# EAGLE design USB_mini_board (EAGLE 9.6.2)
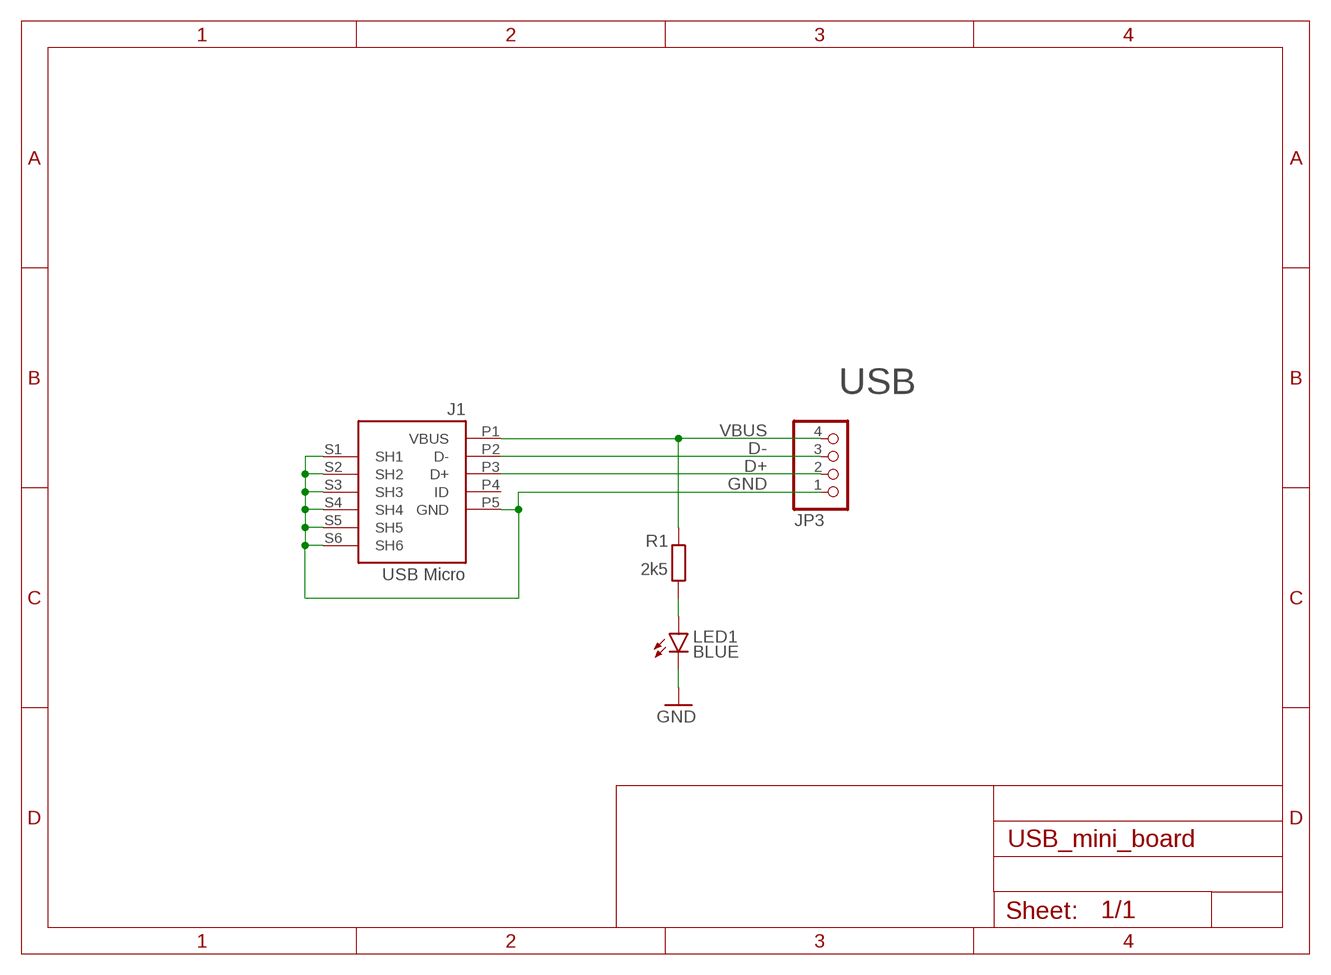
[diagram p0: schematic, sheet 1]

## Parts
J1  USB Micro  USB-MICRO-LEGACY  [CON2_USB_MICRO_B_AT]
JP3  PINHD-1X4  [1X04]
LED1  BLUE  LEDCHIP-LED0805  [CHIP-LED0805]
R1  2k5  R-EU_R1206  [R1206]

## Nets
D+ [usb]: J1.P3(D+) JP3.2
D- [usb]: J1.P2(D-) JP3.3
GND [usb]: J1.P5(GND) J1.S1(SH1) J1.S2(SH2) J1.S3(SH3) J1.S4(SH4) J1.S5(SH5) J1.S6(SH6) JP3.1 LED1.C
N$13: LED1.A R1.2
VBUS [usb]: J1.P1(VBUS) JP3.4 R1.1
Unconnected: J1.P4(ID)

## Notes on the sheet
- USB

## Library data of the parts
J1 = Arduino-connectors:USB-MICRO-LEGACY; DATASHEET: http://media.digikey.com/pdf/Data%20Sheets/FCI%20PDFs/10118193-0001LF_Webpage.PDF; DISTRIBUTOR-LINK: http://www.digikey.it/product-detail/en/10118193-0001LF/609-4616-2-ND/2785388; DISTRIBUTOR-PN: 609-4616-2-ND; MANUFACTURER: FCI; MANUFACTURER-PN: 10118193-0001LF
JP3 = pinhead:PINHD-1X4: PIN HEADER
LED1 = led:LED: LED OSRAM: - CHIPLED LG R971, LG N971, LY N971, LG Q971, LY Q971, LO R971, LY R971 LH N974, LH R974 LS Q976, LO Q976, LY Q976 LO Q996 - Hyper CHIPLED LW Q18S LB Q993, LB Q99A, LB R99A - SideLED LS A670, LO A670, LY A670, LG A670, LP A670 LB A673, LV A673, LT A673, LW A673 LH A674 LY A675 LS A676, LA A676, LO A676, LY A676, LW A676 LS A679, LY A679, LG A679 - Hyper Micro SIDELED® LS Y876, LA Y876, LO Y876, LY Y876 LT Y87S - SmartLED LW L88C, LW L88S LB L89C, LB L89S, LG L890 LS L89K, LO L89K, LY L89K LS L896, LA L896, LO L896, LY L896 - TOPLED LS T670, LO T670, LY T670, LG T670, LP T670 LSG T670, LSP T670, LSY T670, LOP T670, LYG T670 LG T671, LOG T671, LSG T671 LB T673, LV T673, LT T673, LW T673 LH T674 LS T676, LA T676, LO T676, LY T676, LB T676, LH T676, LSB T676, LW T676 LB T67C, LV T67C, LT T67C, LS T67K, LO T67K, LY T67K, LW E67C LS E67B, LA E67B, LO E67B, LY E67B, LB E67C, LV E67C, LT E67C LW T67C LS T679, LY T679, LG T679 LS T770, LO T770, LY T770, LG T770, LP T770 LB T773, LV T773, LT T773, LW T773 LH T774 LS E675, LA E675, LY E675, LS T675 LS T776, LA T776, LO T776, LY T776, LB T776 LHGB T686 LT T68C, LB T68C - Hyper Mini TOPLED® LB M676 - Mini TOPLED Santana® LG M470 LS M47K, LO M47K, LY M47K Source: http://www.osram.convergy.de LUXEON: - LUMILED® LXK2-PW12-R00, LXK2-PW12-S00, LXK2-PW14-U00, LXK2-PW14-V00 LXK2-PM12-R00, LXK2-PM12-S00, LXK2-PM14-U00 LXK2-PE12-Q00, LXK2-PE12-R00, LXK2-PE12-S00, LXK2-PE14-T00, LXK2-PE14-U00 LXK2-PB12-K00, LXK2-PB12-L00, LXK2-PB12-M00, LXK2-PB14-N00, LXK2-PB14-P00, LXK2-PB14-Q00 LXK2-PR12-L00, LXK2-PR12-M00, LXK2-PR14-Q00, LXK2-PR14-R00 LXK2-PD12-Q00, LXK2-PD12-R00, LXK2-PD12-S00 LXK2-PH12-R00, LXK2-PH12-S00 LXK2-PL12-P00, LXK2-PL12-Q00, LXK2-PL12-R00 Source: www.luxeon.com KINGBRIGHT: KA-3528ASYC Source: www.kingbright.com
R1 = rcl:R-EU_: RESISTOR, European symbol; SPICEPREFIX: R

## Net classes
0 default: width 0.61 mm, clearance 0.305 mm
1 usb: width 0.406 mm, clearance 0.076 mm

## Board
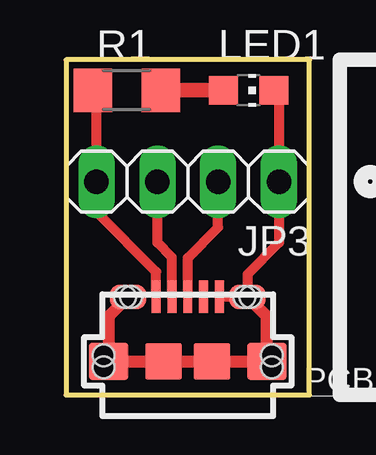
[diagram p1: board, top side]

Size 10.16 x 13.97 mm. Coordinates in mm from the lower left corner, seen from the top.
Outline: 0,0 10.16,0 10.16,13.97 0,13.97 0,0
Copper layers (1*16): Top 0.035mm / dielectric 1.5mm / Bottom 0.035mm
Design rules "default *": minimum track width 6mil, minimum drill 0.35mm, track to track 6mil, track to pad 6mil, pad to pad 6mil, via to via 6mil, smd to smd 6mil, copper to edge 5mil, drill to drill 6mil, minimum pad ring 10mil, minimum via ring 8mil, stop-mask expansion 4mil, vias tented up to drill 0mil, thermal gap 10mil

### Footprints (pad centres in the part's own frame; a part is rotated, then mirrored left to right if it is on the bottom)
CON2_USB_MICRO_B_AT = smd 0.406 x 1.346: P1 -1.321,2.692; P2 -0.66,2.692; P3 0,2.692; P4 0.66,2.692; P5 1.321,2.692 | smd 1.651 x 1.549: S1 -3.302,0; S2 3.302,0 | smd 1.524 x 1.016: S3 -2.489,2.692; S4 2.489,2.692 | smd 1.524 x 1.524: S5 -1.016,0; S6 1.016,0 | hole 0.9: -3.505,0.254; -3.505,-0.254; 3.505,0.254; 3.505,-0.254; -2.616,2.692; -2.362,2.692; 2.362,2.692; 2.616,2.692
1X04 = drill 1.016 long: 1 -3.81,0; 2 -1.27,0; 3 1.27,0; 4 3.81,0
CHIP-LED0805 = smd 1.2 x 1.2: A 0,-1.05; C 0,1.05
R1206 = smd 1.6 x 1.803: 1 -1.422,0; 2 1.422,0

### Placement (x,y rotation side)
J1  5.08,1.4 0 top
JP3  5.08,8.89 180 top
LED1  7.62,12.7 270 top
R1  2.54,12.7 0 top

### Tracks (layer width: path | path; a pad name or v marks a point on that pad's centre or on a via)
D+
  Top 0.406: J1.P3 5.08,5.71 6.35,6.99 JP3.2
D-
  Top 0.406: J1.P2 4.42,5.74 3.81,6.35 JP3.3
GND
  Top 0.406: J1.P5 J1.S4 7.57,5.03 8.89,6.35 JP3.1 8.89,12.48 LED1.C
  Top 0.508: J1.S4 8.38,3.28 J1.S2 J1.S6 J1.S5 J1.S1 1.78,3.28 J1.S3
N$13
  Top 0.61: R1.2 LED1.A
VBUS
  Top 0.406: J1.P1 3.76,5.13 1.27,7.62 JP3.4 1.27,12.55 R1.1